# EAGLE design multiplier (EAGLE 7.2.0)
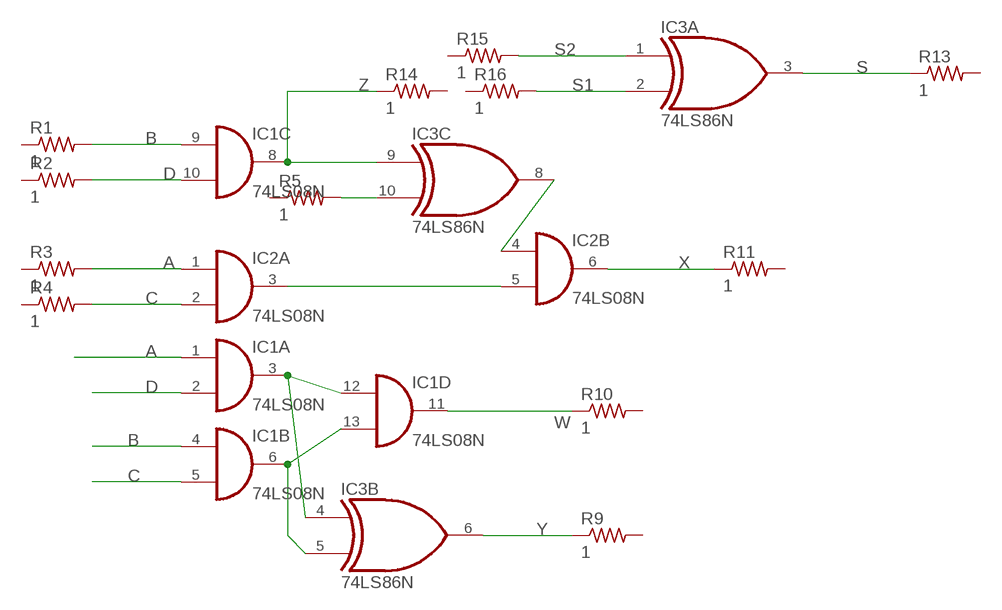
[diagram p0: schematic, sheet 1]

## Parts
IC1  74LS08N  [DIL14]
IC2  74LS08N  [DIL14]
IC3  74LS86N  [DIL14]
R1  1  R-US_0204/2V  [0204V]
R2  1  R-US_0204/2V  [0204V]
R3  1  R-US_0204/2V  [0204V]
R4  1  R-US_0204/2V  [0204V]
R5  1  R-US_0204/2V  [0204V]
R9  1  R-US_0204/2V  [0204V]
R10  1  R-US_0204/2V  [0204V]
R11  1  R-US_0204/2V  [0204V]
R13  1  R-US_0204/2V  [0204V]
R14  1  R-US_0204/2V  [0204V]
R15  1  R-US_0204/2V  [0204V]
R16  1  R-US_0204/2V  [0204V]

## Nets
A: IC1.1(A:I0) IC2.1(A:I0) R3.2
B: IC1.4(B:I0) IC1.9(C:I0) R1.2
C: IC1.5(B:I1) IC2.2(A:I1) R4.2
D: IC1.2(A:I1) IC1.10(C:I1) R2.2
N$1: IC1.3(A:O) IC1.12(D:I0) IC3.4(B:I0)
N$2: IC1.6(B:O) IC1.13(D:I1) IC3.5(B:I1)
N$3: IC3.8(C:O)
N$4: IC3.10(C:I1) R5.2
N$5: IC2.3(A:O) IC2.5(B:I1)
S: IC3.3(A:O) R13.1
S1: IC3.2(A:I1) R16.2
S2: IC3.1(A:I0) R15.2
W: IC1.11(D:O) R10.1
X: IC2.6(B:O) R11.1
Y: IC3.6(B:O) R9.1
Z: IC1.8(C:O) IC3.9(C:I0) R14.1
Unconnected: IC2.4(B:I0) IC2.8(C:O) IC2.9(C:I0) IC2.10(C:I1) IC2.11(D:O) IC2.12(D:I0) IC2.13(D:I1) IC3.11(D:O) IC3.12(D:I0) IC3.13(D:I1) R1.1 R2.1 R3.1 R4.1 R5.1 R9.2 R10.2 R11.2 R13.2 R14.2 R15.1 R16.1

## Power pins joined to a net without a drawn wire
GND: IC1.7(P:GND) IC2.7(P:GND) IC3.7(P:GND)
VCC: IC1.14(P:VCC) IC2.14(P:VCC) IC3.14(P:VCC)

## Library data of the parts
IC1 IC2 = 74xx-eu:74*08: Quad 2-input AND gate
IC3 = 74xx-us:74*86: Quad 2-input EXCLUSIV-OR (XOR) gate
R1-R5 R9-R11 R13-R16 = resistor:R-US_: RESISTOR, American symbol

## Board
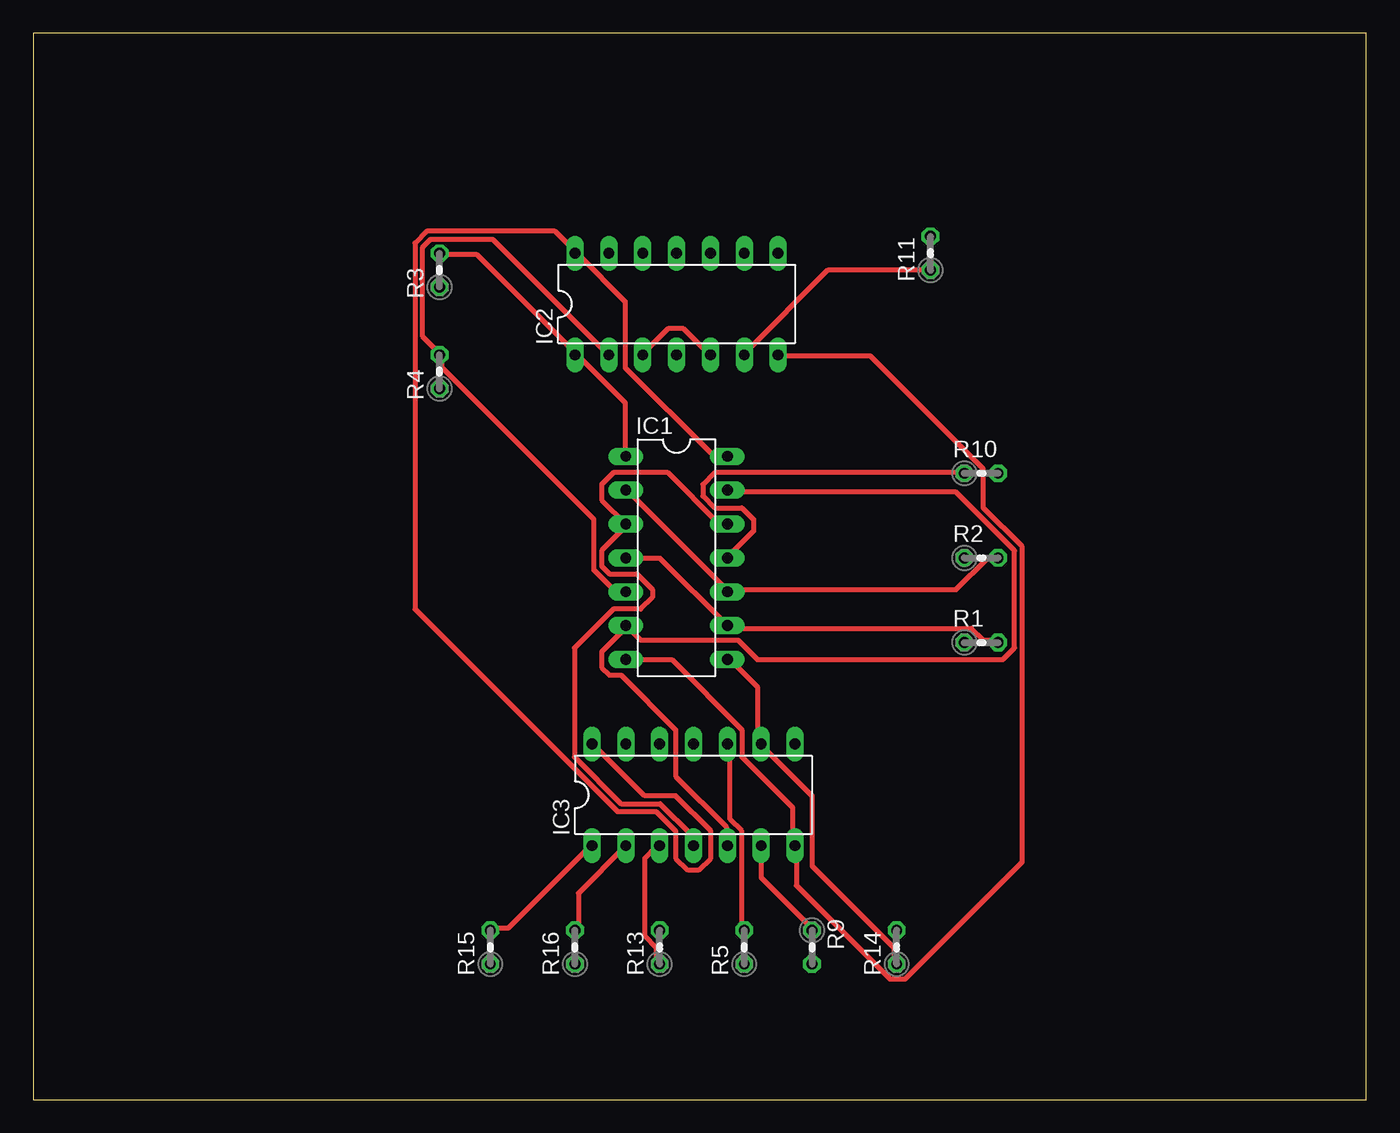
[diagram p1: board, top side]

Size 100 x 80 mm. Coordinates in mm from the lower left corner, seen from the top.
Outline: 0,0 100,0 100,80 0,80 0,0
Copper layers (1*16): Top 0.035mm / dielectric 1.5mm / Bottom 0.035mm
Design rules "default *": minimum track width 15mil, minimum drill 24mil, track to track 8mil, track to pad 8mil, pad to pad 8mil, via to via 8mil, smd to smd 8mil, copper to edge 80mil, drill to drill 16mil, minimum pad ring 10mil, minimum via ring 8mil, stop-mask expansion 4mil, vias tented up to drill 0mil, thermal gap 10mil

### Footprints (pad centres in the part's own frame; a part is rotated, then mirrored left to right if it is on the bottom)
DIL14 = drill 0.813 long: 1 -7.62,-3.81; 2 -5.08,-3.81; 3 -2.54,-3.81; 4 0,-3.81; 5 2.54,-3.81; 6 5.08,-3.81; 7 7.62,-3.81; 8 7.62,3.81; 9 5.08,3.81; 10 2.54,3.81; 11 0,3.81; 12 -2.54,3.81; 13 -5.08,3.81; 14 -7.62,3.81
0204V = drill 0.813 octagon: 1 -1.27,0; 2 1.27,0

### Placement (x,y rotation side)
IC1  48.26,40.64 270 top
IC2  48.26,59.69 0 top
IC3  49.53,22.86 0 top
R1  71.12,34.29 0 top
R2  71.12,40.64 0 top
R3  30.48,62.23 90 top
R4  30.48,54.61 90 top
R5  53.34,11.43 90 top
R9  58.42,11.43 270 top
R10  71.12,46.99 0 top
R11  67.31,63.5 90 top
R13  46.99,11.43 90 top
R14  64.77,11.43 90 top
R15  34.29,11.43 90 top
R16  40.64,11.43 90 top

### Tracks (layer width: path | path; a pad name or v marks a point on that pad's centre or on a via)
A
  Top 0.381: R3.2 30.67,63.39 33.3,63.39 40.6,56.08 IC2.1 40.89,55.79 44.4,52.29 44.4,48.49 IC1.1
B
  Top 0.381: R1.2 72.15,34.47 71.27,34.47 70.4,35.34 52.29,35.34 IC1.9 47.03,40.6 44.69,40.6 IC1.4
C
  Top 0.381: IC1.5 44.4,38.27 43.52,38.27 42.06,39.73 42.06,43.52 30.67,54.91 30.67,55.79 R4.2 30.38,56.08 29.21,57.25 29.21,63.97 29.79,64.55 34.47,64.55 42.94,56.08 IC2.2
D
  Top 0.381: IC1.2 44.69,45.57 51.99,38.27 IC1.10 52.29,38.27 69.23,38.27 71.56,40.6 72.15,40.6 R2.2
GND
  Top 0.381: IC1.7 44.69,33.01 47.9,33.01 53.16,27.75 53.16,25.7 56.96,21.91 56.96,19.28 IC3.7 57.25,18.99 57.25,16.07 64.26,9.05 65.43,9.05 74.19,17.82 74.19,41.48 71.27,44.4 71.27,47.32 62.8,55.79 56.08,55.79 IC2.7
N$1
  Top 0.381: IC1.12 51.99,43.23 51.41,43.23 47.61,47.03 43.52,47.03 42.65,46.15 42.65,44.98 IC1.3 44.4,42.94 42.65,41.19 42.65,40.02 43.23,39.43 45.28,39.43 46.44,38.27 46.44,37.68 45.57,36.8 43.52,36.8 40.6,33.88 40.6,25.7 44.11,22.2 47.03,22.2 49.37,19.86 49.37,19.28 IC3.4
N$2
  Top 0.381: IC3.5 51.99,19.28 51.99,20.45 48.2,24.24 48.2,27.75 44.11,31.84 43.23,31.84 42.65,32.42 42.65,33.59 44.4,35.34 IC1.6 44.69,35.34 45.57,34.47 52.87,34.47 54.33,33.01 72.73,33.01 73.61,33.88 73.61,41.19 69.23,45.57 52.29,45.57 IC1.13
N$4
  Top 0.381: IC3.10 52.29,26.58 52.29,21.03 53.16,20.16 53.16,12.85 R5.2
N$5
  Top 0.381: IC2.3 45.86,56.08 47.61,57.84 48.78,57.84 50.53,56.08 IC2.5
S
  Top 0.381: R13.1 46.74,10.22 46.74,11.39 45.86,12.27 45.86,18.11 46.74,18.99 IC3.3
S1
  Top 0.381: R16.2 40.89,12.85 40.89,15.48 44.4,18.99 IC3.2
S2
  Top 0.381: R15.2 34.47,12.85 35.64,12.85 41.77,18.99 IC3.1
VCC
  Top 0.381: IC3.14 42.06,26.58 45.86,22.78 48.2,22.78 50.83,20.16 50.83,18.11 49.95,17.23 49.07,17.23 48.2,18.11 48.2,20.16 46.74,21.61 43.81,21.61 28.63,36.8 28.63,64.26 29.5,65.14 39.14,65.14 40.6,63.68 IC2.14 40.89,63.39 44.4,59.88 44.4,54.91 50.83,48.49 51.99,48.49 IC1.14
W
  Top 0.381: IC1.11 52.29,40.89 54.04,42.65 54.04,43.52 53.16,44.4 51.12,44.4 50.24,45.28 50.24,46.15 51.12,47.03 69.81,47.03 R10.1
X
  Top 0.381: IC2.6 53.45,56.08 59.59,62.22 67.18,62.22 R11.1
Y
  Top 0.381: IC3.6 54.62,18.99 54.62,16.65 58.42,12.85 R9.1
Z
  Top 0.381: IC1.8 52.29,33.01 54.33,30.96 54.33,26.87 IC3.9 54.62,26.58 58.42,22.78 58.42,17.53 64.55,11.39 64.55,10.22 R14.1